# EAGLE design 4 Stepper motor control board (EAGLE 9.6.2)
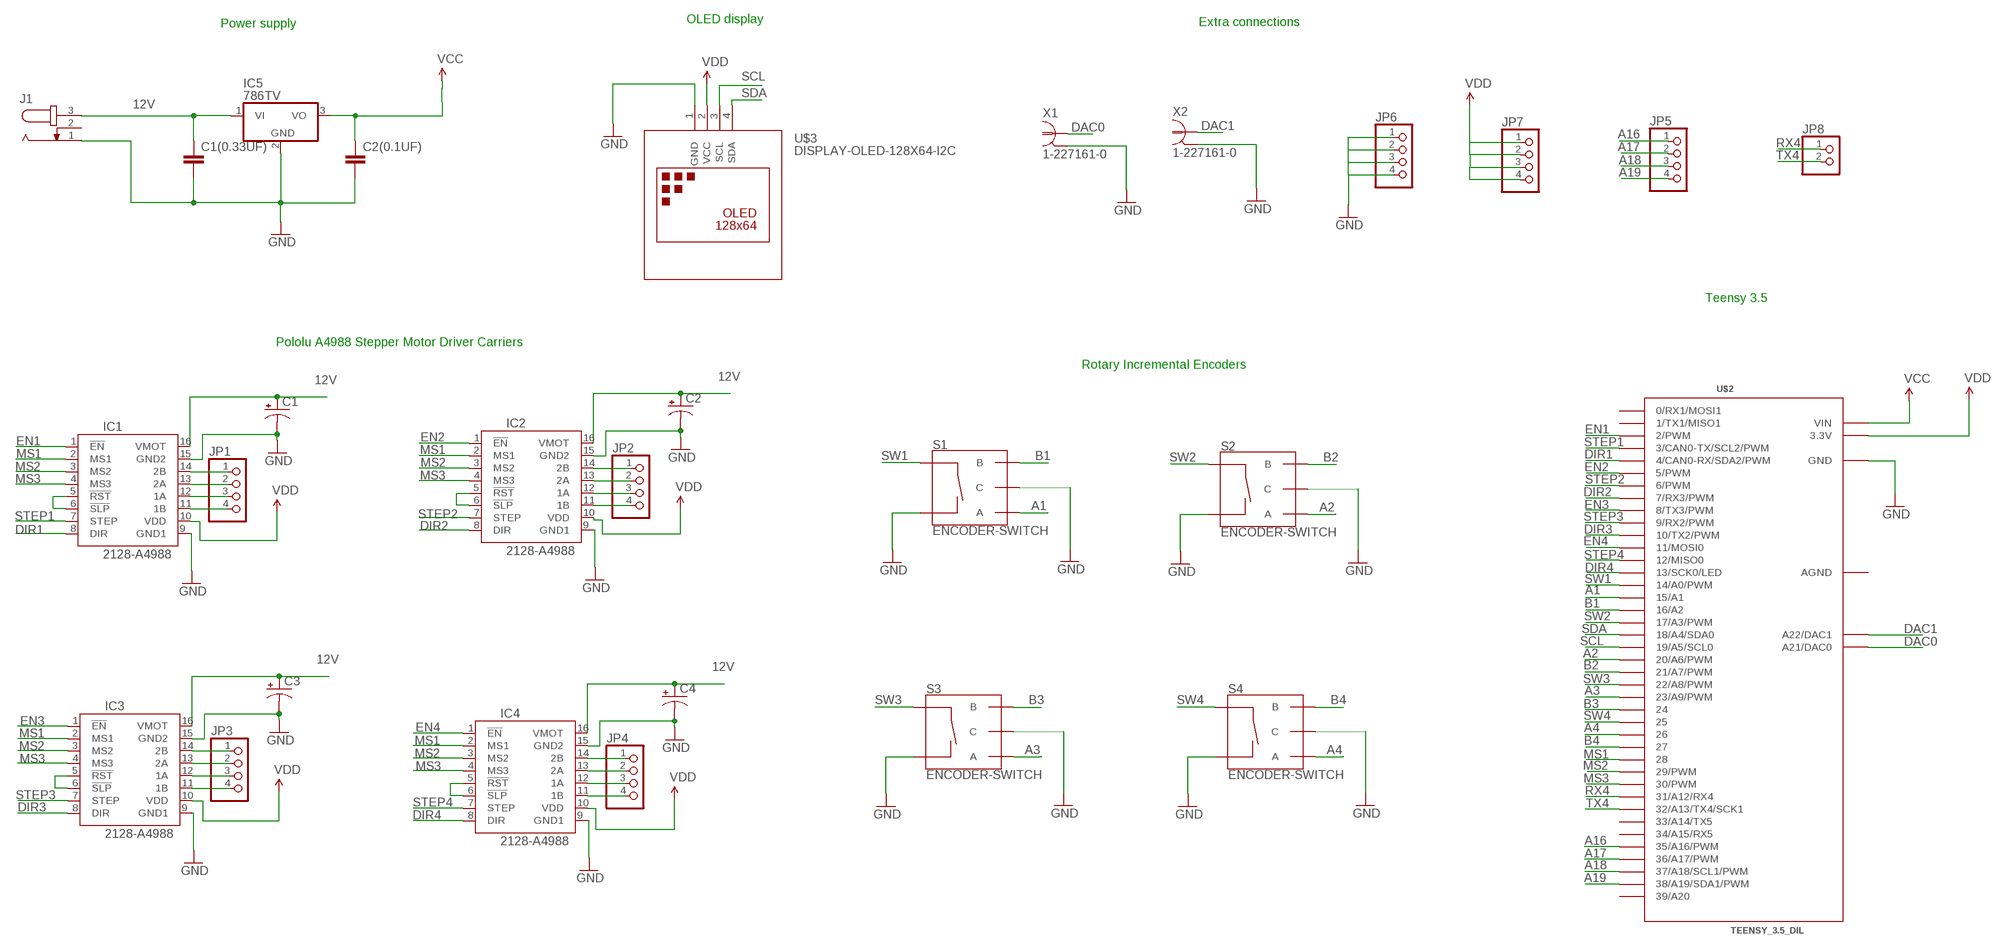
[diagram p0: schematic, sheet 1]

## Parts
C1  CPOL-USE5-5  [E5-5]
C1(0.33UF)  C2.5/4  [C2.5-4]
C2  CPOL-USE5-5  [E5-5]
C2(0.1UF)  C2.5/2  [C2.5-2]
C3  CPOL-USE5-5  [E5-5]
C4  CPOL-USE5-5  [E5-5]
IC1  2128-A4988  [A4988]
IC2  2128-A4988  [A4988]
IC3  2128-A4988  [A4988]
IC4  2128-A4988  [A4988]
IC5  786TV  [TO220V]
J1  JACK-PLUG0  [SPC4077]
JP1  PINHD-1X4  [1X04]
JP2  PINHD-1X4  [1X04]
JP3  PINHD-1X4  [1X04]
JP4  PINHD-1X4  [1X04]
JP5  PINHD-1X4  [1X04]
JP6  PINHD-1X4  [1X04]
JP7  PINHD-1X4  [1X04]
JP8  PINHD-1X2  [1X02]
S1  ENCODER-SWITCH  [ROTARY_ENC_PLAIN]
S2  ENCODER-SWITCH  [ROTARY_ENC_PLAIN]
S3  ENCODER-SWITCH  [ROTARY_ENC_PLAIN]
S4  ENCODER-SWITCH  [ROTARY_ENC_PLAIN]
U$2  TEENSY_3.5_DIL  [TEENSY_3.5_DIL]
U$3  DISPLAY-OLED-128X64-I2C  [DISPLAY-OLED-128X64-I2C]
X1  1-227161-0  [AMP_227161]
X2  1-227161-0  [AMP_227161]

## Nets
12V: C1(0.33UF).1 C1.+ C2.+ C3.+ C4.+ IC1.16(VMOT) IC2.16(VMOT) IC3.16(VMOT) IC4.16(VMOT) IC5.1(VI) J1.3
A1: S1.A U$2.15/A1
A2: S2.A U$2.20/A6(20/A6/PWM)
A3: S3.A U$2.23/A9(23/A9/PWM)
A4: S4.A U$2.26
A16: JP5.1 U$2.35/A16(35/A16/PWM)
A17: JP5.2 U$2.36/A17(36/A17/PWM)
A18: JP5.3 U$2.37/A18(37/A18/SCL1/PWM)
A19: JP5.4 U$2.38/A19(38/A19/SDA1/PWM)
B1: S1.B U$2.16/A2
B2: S2.B U$2.21/A7(21/A7/PWM)
B3: S3.B U$2.24
B4: S4.B U$2.27
DAC0: U$2.A21(A21/DAC0) X1.1
DAC1: U$2.A22(A22/DAC1) X2.1
DIR1: IC1.8(DIR) U$2.4(4/CAN0-RX/SDA2/PWM)
DIR2: IC2.8(DIR) U$2.7(7/RX3/PWM)
DIR3: IC3.8(DIR) U$2.10(10/TX2/PWM)
DIR4: IC4.8(DIR) U$2.13(13/SCK0/LED)
EN1: IC1.1(!EN) U$2.2(2/PWM)
EN2: IC2.1(!EN) U$2.5(5/PWM)
EN3: IC3.1(!EN) U$2.8(8/TX3/PWM)
EN4: IC4.1(!EN) U$2.11(11/MOSI0)
GND: C1(0.33UF).2 C1.- C2(0.1UF).2 C2.- C3.- C4.- IC1.9(GND1) IC1.15(GND2) IC2.9(GND1) IC2.15(GND2) IC3.9(GND1) IC3.15(GND2) IC4.9(GND1) IC4.15(GND2) IC5.2(GND) J1.1 JP6.1 JP6.2 JP6.3 JP6.4 S1.C S1.SW- S2.C S2.SW- S3.C S3.SW- S4.C S4.SW- U$2.GND U$2.GND1(GND) U$3.1(GND) X1.2 X2.2
MS1: IC1.2(MS1) IC2.2(MS1) IC3.2(MS1) IC4.2(MS1) U$2.28
MS2: IC1.3(MS2) IC2.3(MS2) IC3.3(MS2) IC4.3(MS2) U$2.29(29/PWM)
MS3: IC1.4(MS3) IC2.4(MS3) IC3.4(MS3) IC4.4(MS3) U$2.30(30/PWM)
N$1: IC1.14(2B) JP1.1
N$2: IC1.13(2A) JP1.2
N$3: IC1.12(1A) JP1.3
N$4: IC1.11(1B) JP1.4
N$5: IC2.14(2B) JP2.1
N$6: IC2.13(2A) JP2.2
N$7: IC2.12(1A) JP2.3
N$8: IC2.11(1B) JP2.4
N$15: IC2.5(!RST) IC2.6(!SLP)
N$23: IC1.5(!RST) IC1.6(!SLP)
N$24: IC3.14(2B) JP3.1
N$25: IC3.13(2A) JP3.2
N$26: IC3.12(1A) JP3.3
N$27: IC3.11(1B) JP3.4
N$35: IC3.5(!RST) IC3.6(!SLP)
N$37: IC4.14(2B) JP4.1
N$38: IC4.13(2A) JP4.2
N$39: IC4.12(1A) JP4.3
N$40: IC4.11(1B) JP4.4
N$47: IC4.5(!RST) IC4.6(!SLP)
RX4: JP8.1 U$2.31/A12(31/A12/RX4)
SCL: U$2.19/A5(19/A5/SCL0) U$3.3(SCL)
SDA: U$2.18/A4(18/A4/SDA0) U$3.4(SDA)
STEP1: IC1.7(STEP) U$2.3(3/CAN0-TX/SCL2/PWM)
STEP2: IC2.7(STEP) U$2.6(6/PWM)
STEP3: IC3.7(STEP) U$2.9(9/RX2/PWM)
STEP4: IC4.7(STEP) U$2.12(12/MISO0)
SW1: S1.SW+ U$2.14/A0(14/A0/PWM)
SW2: S2.SW+ U$2.17/A3(17/A3/PWM)
SW3: S3.SW+ U$2.22/A8(22/A8/PWM)
SW4: S4.SW+ U$2.25
TX4: JP8.2 U$2.32/A13(32/A13/TX4/SCK1)
VCC: C2(0.1UF).1 IC5.3(VO) U$2.VIN
VDD: IC1.10(VDD) IC2.10(VDD) IC3.10(VDD) IC4.10(VDD) JP7.1 JP7.2 JP7.3 JP7.4 U$2.3.3V U$2.3.3V3(3.3V) U$3.2(VCC)
Unconnected: J1.2 U$2.0(0/RX1/MOSI1) U$2.1(1/TX1/MISO1) U$2.33/A14(33/A14/TX5) U$2.34/A15(34/A15/RX5) U$2.39/A20

## Notes on the sheet
- OLED display | Extra connections
- Power supply
- Teensy 3.5
- Pololu A4988 Stepper Motor Driver Carriers
- Rotary Incremental Encoders

## Power pins joined to a net without a drawn wire
AGND: U$2.AGND

## Library data of the parts
C1-C4 = adafruit:CPOL-US: POLARIZED CAPACITOR, American symbol
C1(0.33UF) C2(0.1UF) = capacitor-wima:C: CAPACITOR naming: grid - package width
IC1-IC4 = pololu-stepper-driver:2128-A4988: A4988 Stepper Motor Driver Carrier; Black Edition #2128 A4988 Stepper Motor Driver Carrier; Black Edition <https://www.pololu.com/product/2128> in Japan, Suzaku Lab. Ltd. <https://suzakugiken.jp/> #2128 A4988ステッピングモータドライバ Black Edition <https://szc.jp/po2128>
IC5 = linear:78*: Positive VOLTAGE REGULATOR Source: http://cache.national.com/ds/LM/LM78L05.pdf http://www.fairchildsemi.com/ds/LM/LM7805.pdf
J1 = con-jack:JACK-PLUG: DC POWER JACK Power Jack, DC, Right Angle, Through Hole, Rated 5A at 16VDC, PC Terminals Distributor: Farnell (www.Farnell.de) Drawing: 84N1161.pdf / 84N1162.pdf Manufacturer: SPC Technology (www.spctechnology.com) Type: SPC4077 / SPC 4078; OC_FARNELL: unknown; OC_NEWARK: unknown
JP1-JP7 = pinhead:PINHD-1X4: PIN HEADER
JP8 = pinhead:PINHD-1X2: PIN HEADER
S1-S4 = SparkFun-Switches:ENCODER-SWITCH: Rotary Encoder w/ Select Switch Encoders rotate similarly to potentiometers, but they’re different from potentiometers in that an encoder has full rotation without limits. They output gray code so that you can tell how much and in which direction the encoder has been turned. This encoder includes a push-down select switch built into the shaft. SparkFun Products Rotary Encoder <https://www.sparkfun.com/products/9117> (COM-09117); SF_SKU: COM-09117
U$2 = Teensy_3_and_LC_Series_Boards_v1.4:TEENSY_3.5_DIL: DIL version of the Teensy 3.5
U$3 = diy-modules:DISPLAY-OLED-128X64-I2C: 128x64 Dot Matrix OLED Module based on SSD1306 chip Variant with I2C interface More details available here: http://www.instructables.com/id/Monochrome-096-i2c-OLED-display-with-arduino-SSD13/ SSD1306 datasheet: https://cdn-shop.adafruit.com/datasheets/SSD1306.pdf Click here to find device on ebay.com <http://www.ebay.com/sch/oled+display+128x64+iic> Note: There are two variants: I2C and SPI. Search for the proper version.
X1 X2 = con-coax_xavi:?227161*: JACK, RIGHT ANGLE, 50 OHM, PCB, BNC Source: amp_227161.pdf; MF: TYCO ELECTRONICS; MPN: 1-227161; OC_FARNELL: unknown; OC_NEWARK: 33B3200

## Net classes
0 default: width 0.203 mm, drill 0.406 mm, clearance 0.203 mm

## Board
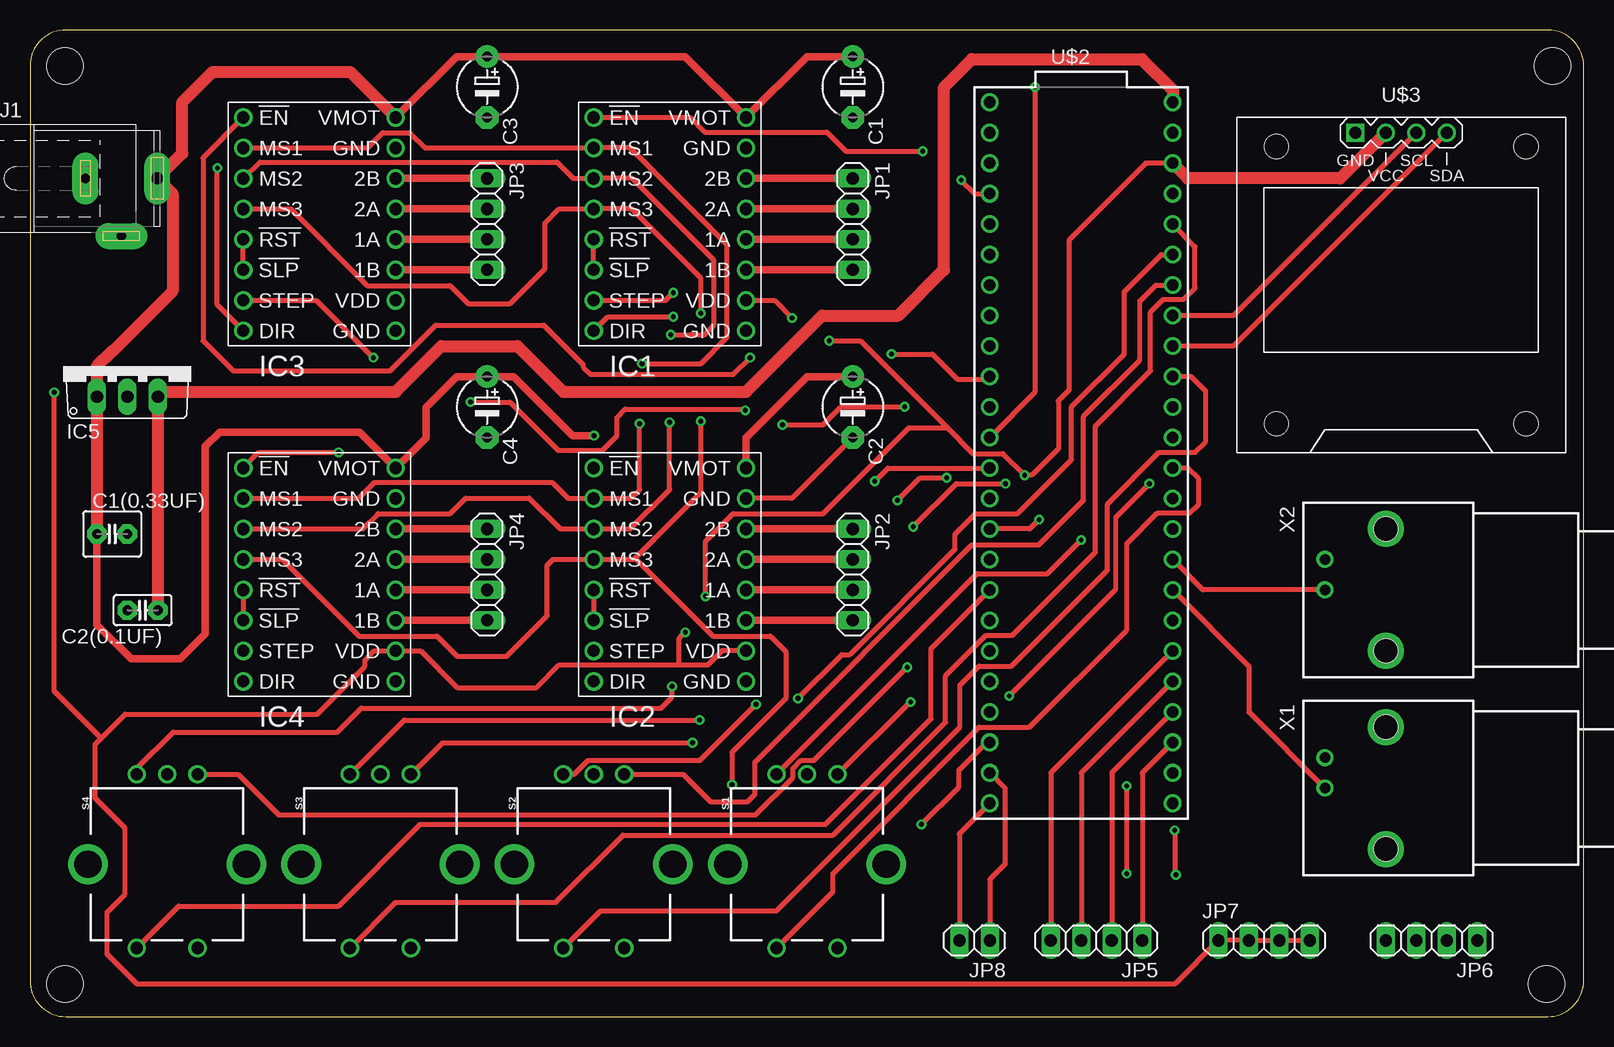
[diagram p1: board, top side]
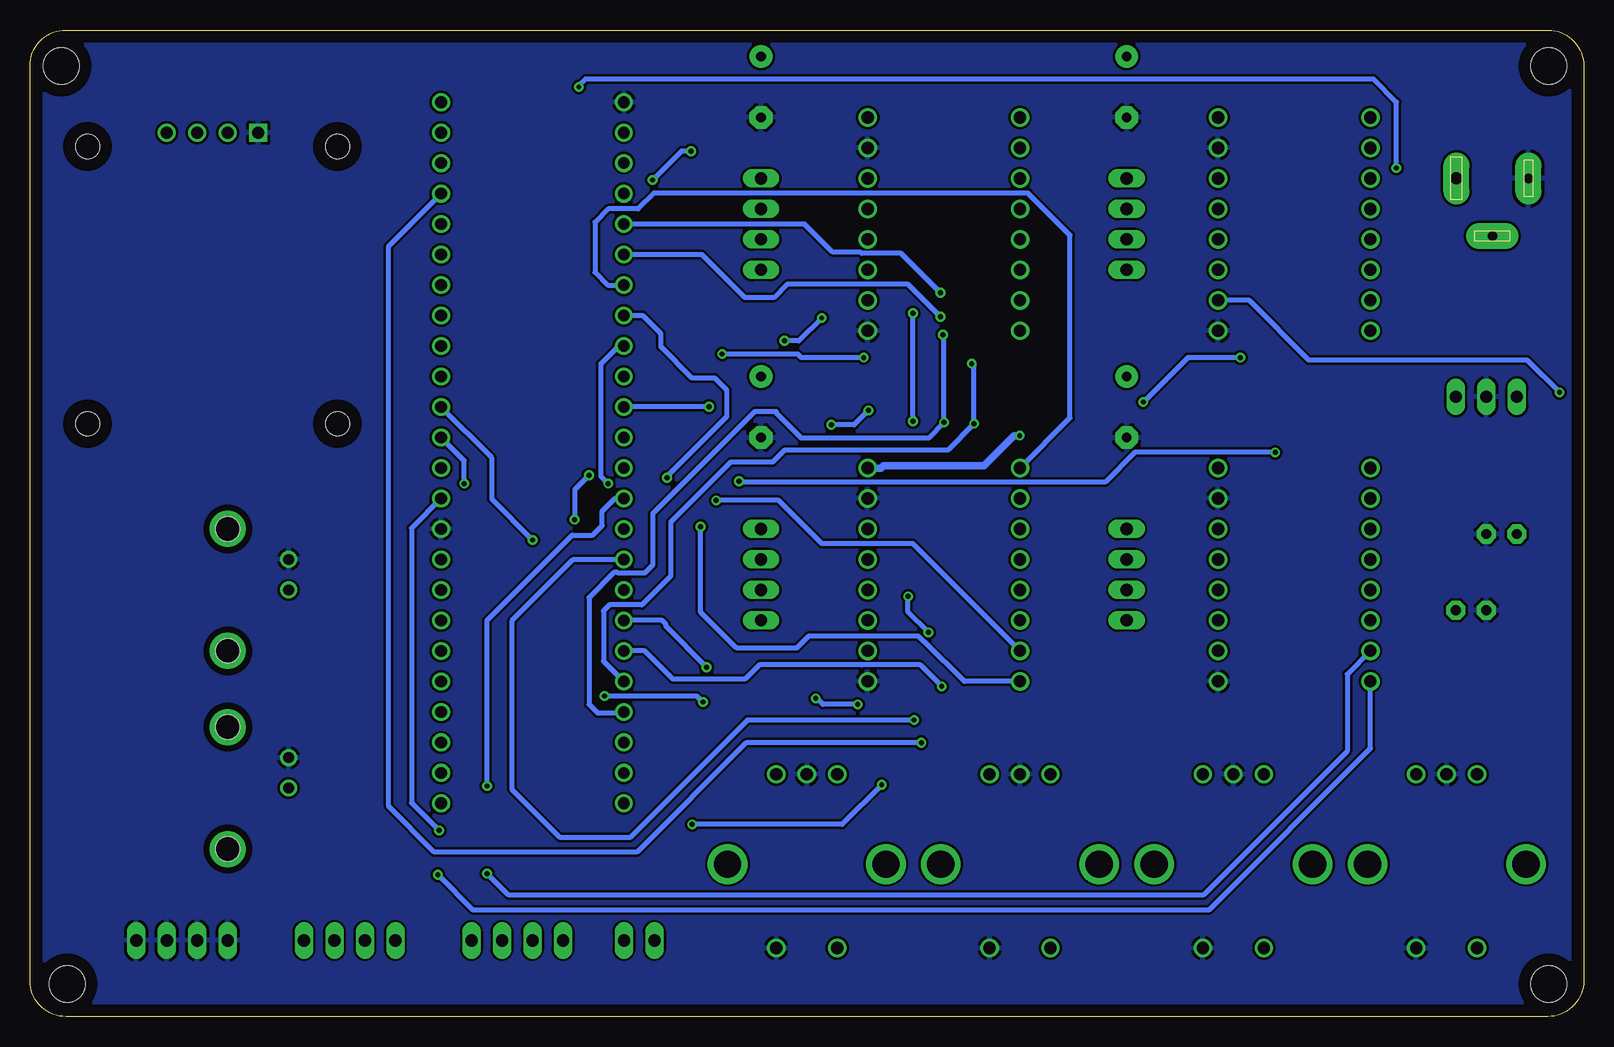
[diagram p2: board, bottom side, seen from below]

Size 129.52 x 82.22 mm. Coordinates in mm from the lower left corner, seen from the top.
Outline: 0,79.22 0,3 arc90 3,0 126.52,0 arc90 129.52,3 129.52,79.22 arc90 126.52,82.22 3,82.22 arc90 0,79.22
Copper layers (1*16): Top 0.035mm / dielectric 1.5mm / Bottom 0.035mm
Design rules "default": minimum track width 6mil, minimum drill 0.35mm, track to track 6mil, track to pad 6mil, pad to pad 6mil, via to via 6mil, smd to smd 6mil, copper to edge 40mil, drill to drill 6mil, minimum pad ring 10mil, minimum via ring 8mil, stop-mask expansion 4mil, vias tented up to drill 0mil, thermal gap 10mil
Holes 3 mm at 126.92,79.22 126.42,2.72 2.92,2.72 2.92,79.22

### Footprints (pad centres in the part's own frame; a part is rotated, then mirrored left to right if it is on the bottom)
E5-5 = drill 0.813 pad 1.905: + -2.54,0 | drill 0.813 pad 1.905 octagon: - 2.54,0
C2.5-4 = drill 0.813 pad 1.6 octagon: 1 -1.27,0; 2 1.27,0
C2.5-2 = drill 0.813 pad 1.6 octagon: 1 -1.27,0; 2 1.27,0
A4988 = drill 1.016: 1 -6.35,8.89; 2 -6.35,6.35; 3 -6.35,3.81; 4 -6.35,1.27; 5 -6.35,-1.27; 6 -6.35,-3.81; 7 -6.35,-6.35; 8 -6.35,-8.89; 9 6.35,-8.89; 10 6.35,-6.35; 11 6.35,-3.81; 12 6.35,-1.27; 13 6.35,1.27; 14 6.35,3.81; 15 6.35,6.35; 16 6.35,8.89
TO220V = drill 1.016 long: 1 -2.54,-2.54; 2 0,-2.54; 3 2.54,-2.54
SPC4077 = drill 0.8 pad 2.184 long: 1 -3,0; 2 0,-4.8 | drill 1 pad 2.184 long: 3 3,0
1X04 = drill 1.016 long: 1 -3.81,0; 2 -1.27,0; 3 1.27,0; 4 3.81,0
1X02 = drill 1.016 long: 1 -1.27,0; 2 1.27,0
ROTARY_ENC_PLAIN = drill 1.016: A 7.493,-2.54; B 7.493,2.54; C 7.493,0; SW+ -6.985,2.54; SW- -6.985,-2.54 | drill 2.286: P$3 0,6.604; P$4 0,-6.604
TEENSY_3.5_DIL = drill 0.965: 0 -7.62,26.67; 1 -7.62,24.13; 2 -7.62,21.59; 3 -7.62,19.05; 3.3V 7.62,24.13; 3.3V3 -7.62,-6.35; 4 -7.62,16.51; 5 -7.62,13.97; 6 -7.62,11.43; 7 -7.62,8.89; 8 -7.62,6.35; 9 -7.62,3.81; 10 -7.62,1.27; 11 -7.62,-1.27; 12 -7.62,-3.81; 13 7.62,-3.81; 14/A0 7.62,-1.27; 15/A1 7.62,1.27; 16/A2 7.62,3.81; 17/A3 7.62,6.35; 18/A4 7.62,8.89; 19/A5 7.62,11.43; 20/A6 7.62,13.97; 21/A7 7.62,16.51; 22/A8 7.62,19.05; 23/A9 7.62,21.59; 24 -7.62,-8.89; 25 -7.62,-11.43; 26 -7.62,-13.97; 27 -7.62,-16.51; 28 -7.62,-19.05; 29 -7.62,-21.59; 30 -7.62,-24.13; 31/A12 -7.62,-26.67; 32/A13 -7.62,-29.21; 33/A14 7.62,-29.21; 34/A15 7.62,-26.67; 35/A16 7.62,-24.13; 36/A17 7.62,-21.59; 37/A18 7.62,-19.05; 38/A19 7.62,-16.51; 39/A20 7.62,-13.97; A21 7.62,-11.43; A22 7.62,-8.89; AGND 7.62,26.67; GND -7.62,29.21; GND1 7.62,-6.35; VIN 7.62,29.21
DISPLAY-OLED-128X64-I2C = drill 1 square: 1 -3.81,12.7 | drill 1: 2 -1.27,12.7; 3 1.27,12.7; 4 3.81,12.7 | hole 2: -10.414,11.557; 10.414,11.557; 10.414,-11.557; -10.414,-11.557
AMP_227161 = drill 0.9 pad 1.27: 1 0,-5.08; 2 -2.54,-5.08 | drill 2: P$1 -5.08,0; P$2 5.08,0 | hole 2: -5.08,0; 5.08,0

### Placement (x,y rotation side)
C1  68.58,77.47 270 top
C1(0.33UF)  6.85,40.22 0 top
C2  68.58,50.8 270 top
C2(0.1UF)  9.39,33.87 180 top
C3  38.1,77.47 270 top
C4  38.1,50.8 270 top
IC1  53.34,66.04 0 top
IC2  53.34,36.83 0 top
IC3  24.13,66.04 0 top
IC4  24.13,36.83 0 top
IC5  8.12,54.19 0 top
J1  7.62,69.85 0 top
JP1  68.58,66.04 270 top
JP2  68.58,36.83 270 top
JP3  38.1,66.04 270 top
JP4  38.1,36.83 270 top
JP5  88.9,6.35 180 top
JP6  116.84,6.35 180 top
JP7  102.87,6.35 0 top
JP8  78.74,6.35 180 top
S1  64.77,12.7 90 top
S2  46.99,12.7 90 top
S3  29.21,12.7 90 top
S4  11.43,12.7 90 top
U$2  87.63,46.99 0 top
U$3  114.3,60.96 0 top
X1  113.03,19.05 270 top
X2  113.03,35.56 270 top

### Tracks (layer width: path | path; a pad name or v marks a point on that pad's centre or on a via)
12V  (via drill 0.41)
  Top 0.61: IC3.16 35.56,80.01 C3.+ 54.61,80.01 IC1.16 64.77,80.01 C1.+ | C2.+ 64.77,53.34 59.69,48.26 IC2.16 | v47.02,48.42 45.22,48.42 40.3,53.34 C4.+ 35.56,53.34 33.02,50.8 33.02,48.26 IC4.16 27.48,48.72 15.82,48.72 14.62,47.52 14.62,31.92 12.52,29.82 8.42,29.82 5.58,32.66 C1(0.33UF).1
  Top 1.016: IC3.16 26.67,78.74 15.24,78.74 12.7,76.2 12.7,71.93 J1.3 11.89,68.58 11.89,60.46 6.89,55.46 6.85,55.46 5.58,54.19 IC5.1 C1(0.33UF).1
  Bottom 0.61: v47.02,48.42 47.52,48.42 50.02,45.92 58.39,45.92 58.59,45.72 IC2.16
A1  (via drill 0.41)
  Top 0.406: S1.A 73.34,26.22 v73.42,26.22 | v81.62,26.72 90.52,35.62 90.52,41.62 v93.32,44.42
  Bottom 0.406: v73.42,26.22 73.92,26.72 v81.62,26.72 | v93.32,44.42 93.32,46.33 U$2.15/A1
A2
  Top 0.406: S2.A 54.45,20.19 56.72,17.92 59.82,17.92 60.42,18.52 60.42,21.22 78.52,39.32 84.12,39.32 87.82,43.02 87.82,50.02 92.52,54.72 92.52,59.62 93.86,60.96 U$2.20/A6
A3  (via drill 0.41)
  Top 0.406: S3.A 34.38,22.82 v55.22,22.82
  Bottom 0.406: v55.22,22.82 69.82,22.82 78.92,13.72 95.82,13.72 99.62,17.52 99.62,64.21 U$2.23/A9
A4  (via drill 0.41)
  Top 0.406: S4.A 17.35,20.19 20.72,16.82 56.96,16.82 56.97,16.81 60.5,16.81 63.6,19.91 63.6,20.68 64.29,21.36 65.36,21.36 v73.12,29.12
  Bottom 0.406: v73.12,29.12 76.52,32.52 76.52,32.72 76.82,33.02 U$2.26
A16
  Top 0.406: U$2.35/A16 92.71,20.32 JP5.1
A17
  Top 0.406: U$2.36/A17 90.17,20.32 JP5.2
A18
  Top 0.406: U$2.37/A18 87.63,20.32 JP5.3
A19
  Top 0.406: U$2.38/A19 85.09,20.32 JP5.4
B1  (via drill 0.41)
  Top 0.406: S1.B 78.96,36.92 84.82,36.92 v87.62,39.72
  Bottom 0.406: v87.62,39.72 91.02,43.12 91.02,46.57 U$2.16/A2
B2  (via drill 0.41)
  Top 0.406: S2.B 45.34,20.19 46.51,21.36 55.86,21.36 v60.52,26.02 | v64.02,26.52 67.67,30.17 68.34,30.17 77.12,38.95 77.12,40.22 78.82,41.92 82.32,41.92 86.82,46.42 86.82,50.82 91.22,55.22 91.22,60.42 94.3,63.5 U$2.21/A7
  Bottom 0.406: v60.52,26.02 63.42,26.02 63.92,26.52 v64.02,26.52
B3  (via drill 0.41)
  Top 0.406: S3.B 31.2,24.72 v55.82,24.72
  Bottom 0.406: v55.82,24.72 69.72,24.72 79.52,14.92 85.32,14.92 89.32,18.92 89.32,33.02 84.24,38.1 U$2.24
B4  (via drill 0.41)
  Top 0.406: S4.B 8.89,20.69 11.92,23.72 25.62,23.72 27.62,25.72 52.62,25.72 53.52,26.62 v53.52,27.52
  Bottom 0.406: v53.52,27.52 55.31,29.31 60.17,29.31 60.18,29.32 68.72,29.32 69.92,28.12 75.92,28.12 78.28,30.48 U$2.27
DAC0
  Top 0.406: U$2.A21 101.6,29.21 101.6,25.4 X1.1
DAC1
  Top 0.406: U$2.A22 97.79,35.56 X2.1
DIR1  (via drill 0.41)
  Top 0.406: IC1.8 48.16,58.32 v53.62,58.32
  Bottom 0.406: v53.62,58.32 56.32,61.02 66.42,61.02 67.52,59.92 69.92,59.92 73.5,63.5 U$2.4
DIR2  (via drill 0.41)
  Top 0.406: v73.62,40.82 77.22,44.42 v81.32,44.42
  Bottom 0.406: IC2.8 51.64,27.94 54.91,31.21 54.96,31.21 55.47,31.72 64.62,31.72 65.62,30.72 70.62,30.72 73.62,33.72 v73.62,40.82 | v81.32,44.42 81.92,45.02 81.92,54.42 80.46,55.88 U$2.7
DIR3  (via drill 0.41)
  Top 0.406: IC3.8 15.62,59.31 v15.62,70.72 | v83.77,77.47 83.77,52.02 U$2.10
  Bottom 0.406: v15.62,70.72 15.62,76.22 17.52,78.12 83.22,78.12 83.82,77.52 v83.77,77.47
DIR4  (via drill 0.41)
  Top 0.406: v95.42,15.52 95.42,11.92 v95.52,11.82
  Bottom 0.406: U$2.13 97.72,40.71 97.72,17.82 v95.42,15.52 | v95.52,11.82 92.62,8.92 31.22,8.92 17.78,22.36 IC4.8
EN1  (via drill 0.41)
  Top 0.406: IC1.1 55.01,74.93 56.22,73.72 66.42,73.72 68.02,72.12 v74.42,72.12 | v77.62,69.72 78.76,68.58 U$2.2
  Bottom 0.406: v74.42,72.12 75.22,72.12 v77.62,69.72
EN2
  Bottom 0.406: IC2.1 42.82,49.89 42.82,65.12 46.32,68.62 77.52,68.62 78.82,67.32 81.32,67.32 82.42,66.22 82.42,62.02 81.36,60.96 U$2.5
EN3  (via drill 0.41)
  Top 0.406: IC3.1 14.42,71.57 14.42,56.32 16.92,53.82 30.02,53.82 33.82,57.62 42.82,57.62 46.12,54.32 46.12,54.12 46.72,53.52 58.62,53.52 v60.02,54.92 | v71.82,55.22 75.22,55.22 77.32,53.12 79.79,53.12 U$2.8
  Bottom 0.406: v60.02,54.92 65.22,54.92 65.52,55.22 v71.82,55.22
EN4  (via drill 0.41)
  Top 0.406: IC4.1 19.08,47.02 v25.72,47.02 | v70.42,44.62 71.52,45.72 U$2.11
  Bottom 0.406: v25.72,47.02 37.42,47.02 39.89,44.55 70.35,44.55 v70.42,44.62
GND
  Top 0.406: C2.- 63.5,43.18 IC2.15
  pour Bottom: -0.58,83.22 129.92,83.22 130.42,82.72 130.42,-0.28 129.42,-1.28 -0.08,-1.28 -1.08,-0.28 -1.08,82.72
MS1  (via drill 0.41)
  Top 0.406: IC3.2 28.13,72.39 29.4,73.66 31.66,73.66 32.93,72.39 IC1.2 47.02,72.42 50.02,72.42 58.12,64.32 58.12,56.62 55.92,54.42 v51.02,54.42 | IC4.2 27.38,43.18 28.72,44.52 43.52,44.52 44.86,43.18 IC2.2 50.08,43.18 50.82,43.92 v50.82,49.42
  Bottom 0.406: v51.02,54.42 50.82,54.22 v50.82,49.42 53.02,47.22 66.62,47.22 67.62,46.22 71.12,46.22 76.12,41.22 76.12,36.72 78.52,34.32 81.22,34.32 81.72,33.82 81.72,29.62 80.04,27.94 U$2.28
MS2  (via drill 0.41)
  Top 0.406: IC3.3 19.15,71.22 43.92,71.22 45.29,69.85 IC1.3 50.19,69.85 57.02,63.02 57.02,57.62 56.22,56.82 v53.42,56.82 | IC4.3 27.74,40.64 29.02,41.92 35.02,41.92 36.32,43.22 41.62,43.22 44.2,40.64 IC2.3 50.04,40.64 53.32,43.92 v53.32,49.52
  Bottom 0.406: v53.42,56.82 53.32,56.82 v53.32,49.52 54.62,48.22 65.22,48.22 67.32,50.32 67.32,50.42 69.12,50.42 77.62,41.92 77.62,37.62 78.28,36.96 80.48,36.96 80.55,37.02 80.82,37.02 82.92,34.92 82.92,26.02 82.22,25.32 80.09,25.32 U$2.29
MS3  (via drill 0.41)
  Top 0.406: IC3.4 21.73,67.31 28.12,60.92 35.02,60.92 36.52,59.42 40.02,59.42 42.92,62.32 42.92,66.12 44.11,67.31 IC1.4 50.13,67.31 55.92,61.52 v55.92,58.62 | IC4.4 21.04,38.1 27.42,31.72 33.92,31.72 35.62,30.02 39.72,30.02 43.12,33.42 43.12,37.62 43.6,38.1 IC2.4 50.3,38.1 50.42,38.22 | v55.92,49.62 55.92,43.72 50.42,38.22 | 50.42,38.22 56.92,31.72 61.72,31.72 63.02,30.42 63.02,26.52 58.52,22.02 v58.52,19.32 | v74.32,16.02 77.42,19.12 77.42,20.52 79.76,22.86 U$2.30
  Bottom 0.406: v55.92,49.62 v55.92,58.62 | v58.52,19.32 61.82,16.02 v74.32,16.02
N$1
  Top 0.61: IC1.14 JP1.1
N$2
  Top 0.61: IC1.13 JP1.2
N$3
  Top 0.61: IC1.12 JP1.3
N$4
  Top 0.61: IC1.11 JP1.4
N$5
  Top 0.61: IC2.14 JP2.1
N$6
  Top 0.61: IC2.13 JP2.2
N$7
  Top 0.61: IC2.12 JP2.3
N$8
  Top 0.61: IC2.11 JP2.4
N$15
  Top 0.406: IC2.5 IC2.6
N$23
  Top 0.406: IC1.6 IC1.5
N$24
  Top 0.61: IC3.14 JP3.1
N$25
  Top 0.61: IC3.13 JP3.2
N$26
  Top 0.61: IC3.12 JP3.3
N$27
  Top 0.61: IC3.11 JP3.4
N$35
  Top 0.406: IC3.6 IC3.5
N$37
  Top 0.61: IC4.14 JP4.1
N$38
  Top 0.61: IC4.13 JP4.2
N$39
  Top 0.61: IC4.12 JP4.3
N$40
  Top 0.61: IC4.11 JP4.4
N$47
  Top 0.406: IC4.5 IC4.6
RX4
  Top 0.406: U$2.31/A12 81.28,19.05 81.28,12.7 80.01,11.43 JP8.1
SCL
  Top 0.406: U$2.19/A5 100.33,58.42 U$3.3
SDA
  Top 0.406: U$3.4 100.33,55.88 U$2.18/A4
STEP1  (via drill 0.41)
  Top 0.406: IC1.7 52.99,59.69 v53.62,60.32
  Bottom 0.406: v53.62,60.32 56.9,63.6 60.17,63.6 60.29,63.72 62.62,63.72 64.94,66.04 U$2.3
STEP2  (via drill 0.41)
  Top 0.406: v72.32,43.02 74.21,44.91 v76.42,44.91
  Bottom 0.406: IC2.7 54.12,37.61 54.12,37.62 55.92,39.42 63.52,39.42 67.12,43.02 v72.32,43.02 | v76.42,44.91 76.42,45.02 71.42,50.02 71.42,52.22 72.42,53.22 74.32,53.22 76.92,55.82 76.92,56.92 78.42,58.42 U$2.6
STEP3  (via drill 0.41)
  Top 0.406: IC3.7 23.85,59.69 v28.62,54.92 | v36.72,51.22 40.02,51.22 44.02,47.22 47.72,47.22 48.92,48.42 48.92,49.92 49.62,50.62 59.52,50.62 v59.62,50.52 | v62.72,49.32 66.12,49.32 67.62,50.82 v72.92,50.82
  Bottom 0.406: v28.62,54.92 33.02,54.92 v36.72,51.22 | v59.62,50.52 60.82,49.32 v62.72,49.32 | v72.92,50.82 79.99,50.82 U$2.9
STEP4  (via drill 0.41)
  Top 0.406: v91.42,11.92 v91.42,19.22
  Bottom 0.406: IC4.7 19.72,28.54 19.72,22.12 31.72,10.12 89.62,10.12 v91.42,11.92 | v91.42,19.22 91.42,33.02 84.32,40.12 82.62,40.12 81.82,40.92 81.82,42.12 80.76,43.18 U$2.12
SW1
  Top 0.406: S1.SW+ 66.92,10.4 66.92,11.92 79.12,24.12 83.32,24.12 91.42,32.22 91.42,39.42 93.98,41.98 96.68,41.98 97.42,42.72 97.42,44.82 96.52,45.72 U$2.14/A0
SW2
  Top 0.406: S2.SW+ 47.55,8.82 62.22,8.82 77.52,24.12 77.52,27.62 79.12,29.22 81.82,29.22 89.82,37.22 89.82,42.72 94.12,47.02 97.12,47.02 98.02,47.92 98.02,52.12 96.8,53.34 U$2.17/A3
SW3
  Top 0.406: S3.SW+ 30.48,9.52 43.82,9.52 49.42,15.12 66.92,15.12 76.32,24.52 76.32,28.41 79.69,31.78 81.88,31.78 88.82,38.72 88.82,49.22 93.41,53.81 93.41,58.69 94.48,59.76 96.16,59.76 97.12,60.72 97.12,64.17 U$2.22/A8
SW4
  Top 0.406: S4.SW+ 12.4,9.22 25.72,9.22 32.52,16.02 66.32,16.02 75.12,24.82 75.12,30.67 U$2.25
TX4
  Top 0.406: U$2.32/A13 77.47,15.24 JP8.2
VCC
  Top 1.016: C2(0.1UF).1 IC5.3 11.08,52.07 30.48,52.07 34.29,55.88 40.64,55.88 44.45,52.07 59.69,52.07 66.04,58.42 72.39,58.42 76.2,62.23 76.2,77.47 78.52,79.79 92.71,79.79 95.25,77.25 U$2.VIN
VDD  (via drill 0.41)
  Top 0.406: JP7.4 JP7.3 JP7.2 JP7.1 95.43,2.72 8.92,2.72 6.42,5.22 6.42,8.72 7.92,10.22 7.92,15.72 5.42,18.22 5.42,22.72 5.92,23.22 | 5.92,23.22 7.92,25.22 23.92,25.22 27.92,29.22 27.92,29.72 28.68,30.48 IC4.10 32.56,30.48 35.62,27.42 42.22,27.42 44.11,29.31 47.47,29.31 47.48,29.32 54.12,29.32 | IC2.10 59.65,30.52 57.72,30.52 56.52,29.32 54.12,29.32 | IC1.10 62.05,59.69 v63.52,58.22 | v66.62,56.32 69.22,56.32 76.47,49.07 | v84.12,41.42 83.34,40.64 U$2.3.3V3 | 76.47,49.07 78.62,46.92 81.12,46.92 v82.92,45.12 83.52,45.12 85.72,47.32 85.72,51.32 86.62,52.22 86.62,64.72 93.02,71.12 U$2.3.3V | 5.92,23.22 2.02,27.12 v2.02,52.02 | 54.12,29.32 54.12,31.52 v54.62,32.02 | v56.32,35.02 56.32,39.62 58.62,41.92 66.12,41.92 73.27,49.07 76.47,49.07
  Top 1.016: U$2.3.3V 96.52,69.85 109.22,69.85 U$3.2
  Bottom 0.406: v63.52,58.22 65.42,56.32 v66.62,56.32 | v82.92,45.12 84.12,43.92 v84.12,41.42 | v2.02,52.02 4.72,54.72 22.92,54.72 27.89,59.69 IC3.10 | v54.62,32.02 56.32,33.72 v56.32,35.02